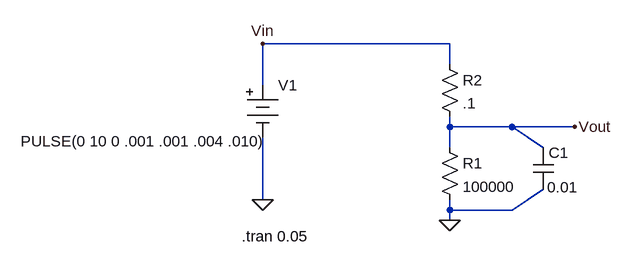
[diagram p0: schematic lab02-Capacitor-battery.asc]
lab02-Capacitor-battery.asc, the LTspice schematic file:
Version 4
SHEET 1 880 680
WIRE 304 32 16 32
WIRE 304 64 304 32
WIRE 16 96 16 32
WIRE 304 160 304 144
WIRE 400 160 304 160
WIRE 496 160 400 160
WIRE 304 192 304 160
WIRE 448 192 400 160
WIRE 16 272 16 176
WIRE 304 288 304 272
WIRE 400 288 448 256
WIRE 400 288 304 288
WIRE 304 304 304 288
FLAG 16 272 0
FLAG 304 304 0
FLAG 16 32 Vin
FLAG 496 160 Vout
SYMBOL res 288 48 R0
SYMATTR InstName R2
SYMATTR Value .1
SYMATTR SpiceLine pwr=0.5
SYMBOL cap 432 192 R0
WINDOW 3 22 61 Left 0
SYMATTR InstName C1
SYMATTR Value 0.01
SYMATTR SpiceLine V=100
SYMBOL Misc\\battery 16 80 R0
WINDOW 123 0 0 Left 0
WINDOW 39 0 0 Left 0
WINDOW 3 -372 102 Left 0
SYMATTR InstName V1
SYMATTR Value PULSE(0 10 0 .001 .001 .004 .010)
SYMBOL res 288 176 R0
SYMATTR InstName R1
SYMATTR Value 100000
TEXT -16 328 Left 0 !.tran 0.05

The netlist it stands for:
* lab02-Capacitor-battery.asc
R2 Vin Vout .1 pwr=0.5
C1 Vout 0 0.01 V=100
V1 Vin 0 PULSE(0 10 0 .001 .001 .004 .010)
R1 Vout 0 100000
.tran 0.05
.backanno
.end